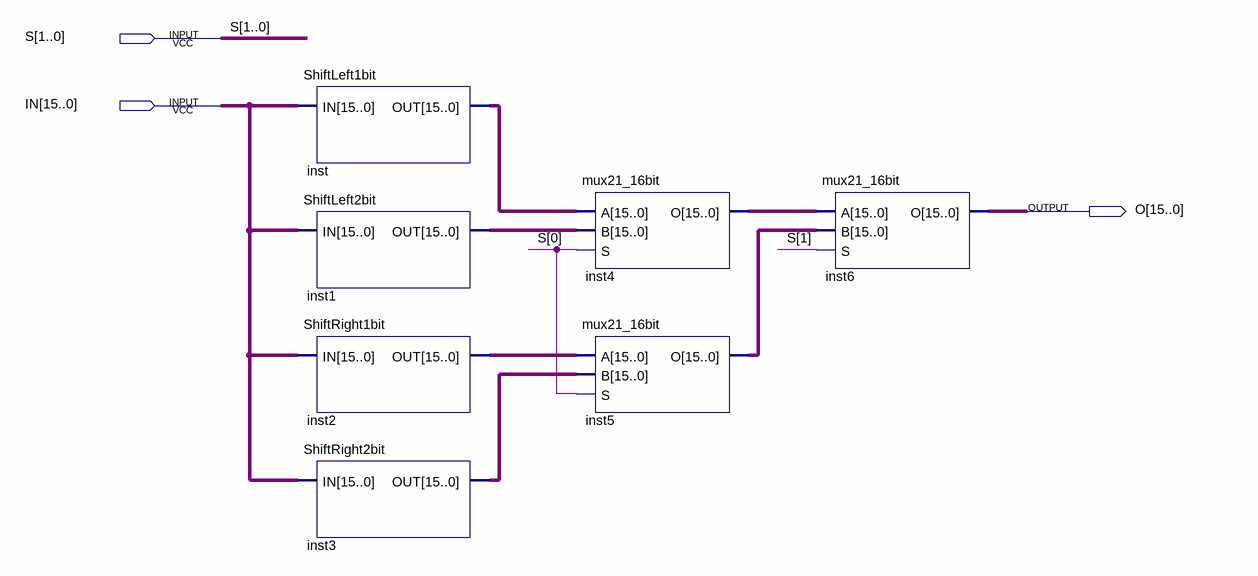
[diagram p0: schematic sheet]
// Quartus schematic KhoiDich.bdf as structural Verilog: 7 symbols, 3 pins
module KhoiDich (
  input  [1:0] S,
  input  [15:0] IN,
  output [15:0] O
);

  wire [15:0] inst1_out, inst2_out, inst3_out, inst4_o, inst5_o, inst_out;

  ShiftLeft1bit inst (.IN(IN), .OUT(inst_out));
  ShiftLeft2bit inst1 (.IN(IN), .OUT(inst1_out));
  ShiftRight1bit inst2 (.IN(IN), .OUT(inst2_out));
  ShiftRight2bit inst3 (.IN(IN), .OUT(inst3_out));
  mux21_16bit inst4 (.A(inst_out), .B(inst1_out), .S(S[0]), .O(inst4_o));
  mux21_16bit inst5 (.A(inst2_out), .B(inst3_out), .S(S[0]), .O(inst5_o));
  mux21_16bit inst6 (.A(inst4_o), .B(inst5_o), .S(S[1]), .O(O));
endmodule
